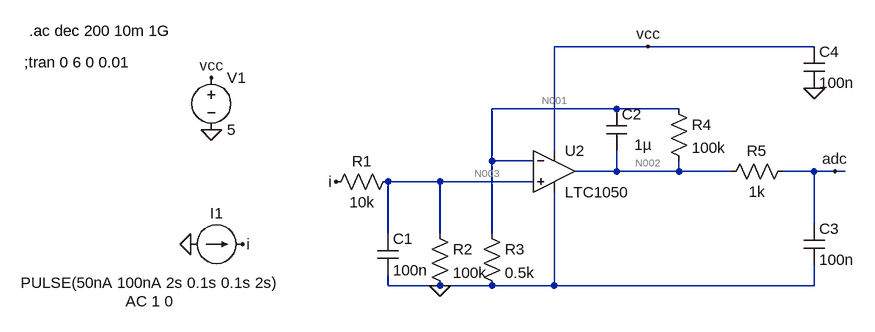
[diagram p0: schematic Draft1.asc]
Draft1.asc, the LTspice schematic file:
Version 4
SHEET 1 1016 680
WIRE 576 -64 432 -64
WIRE 832 -64 576 -64
WIRE 528 32 336 32
WIRE 624 32 528 32
WIRE 432 96 432 -64
WIRE 336 112 336 32
WIRE 400 112 336 112
WIRE 528 128 528 96
WIRE 528 128 464 128
WIRE 624 128 624 112
WIRE 624 128 528 128
WIRE 704 128 624 128
WIRE 832 128 784 128
WIRE 864 128 832 128
WIRE 880 128 864 128
WIRE 256 144 176 144
WIRE 400 144 256 144
WIRE 832 208 832 128
WIRE 176 224 176 144
WIRE 256 224 256 144
WIRE 336 224 336 112
WIRE 176 304 176 288
WIRE 256 304 176 304
WIRE 336 304 256 304
WIRE 432 304 432 160
WIRE 432 304 336 304
WIRE 832 304 832 272
WIRE 832 304 432 304
FLAG -128 240 0
FLAG 256 304 0
FLAG 832 0 0
FLAG 576 -64 vcc
FLAG 864 128 adc
FLAG 96 144 i
FLAG -48 240 i
FLAG -96 64 0
FLAG -96 -16 vcc
SYMBOL res 80 160 R270
WINDOW 0 32 56 VTop 2
WINDOW 3 0 56 VBottom 2
SYMATTR InstName R1
SYMATTR Value 10k
SYMBOL res 240 208 R0
SYMATTR InstName R2
SYMATTR Value 100k
SYMBOL res 320 208 R0
SYMATTR InstName R3
SYMATTR Value 0.5k
SYMBOL cap 160 224 R0
SYMATTR InstName C1
SYMATTR Value 100n
SYMBOL current -128 240 R270
WINDOW 0 32 40 VTop 2
WINDOW 3 -44 -63 VBottom 2
WINDOW 123 -72 -63 VBottom 2
WINDOW 39 0 0 Left 2
SYMATTR InstName I1
SYMATTR Value PULSE(50nA 100nA 2s 0.1s 0.1s 2s)
SYMATTR Value2 AC 1 0
SYMBOL cap 512 32 R0
WINDOW 3 43 55 Left 2
SYMATTR Value 1µ
SYMATTR InstName C2
SYMBOL res 608 16 R0
SYMATTR InstName R4
SYMATTR Value 100k
SYMBOL res 688 144 R270
WINDOW 0 32 56 VTop 2
WINDOW 3 0 56 VBottom 2
SYMATTR InstName R5
SYMATTR Value 1k
SYMBOL cap 816 208 R0
SYMATTR InstName C3
SYMATTR Value 100n
SYMBOL cap 816 -64 R0
SYMATTR InstName C4
SYMATTR Value 100n
SYMBOL voltage -96 -32 R0
SYMATTR InstName V1
SYMATTR Value 5
SYMBOL Opamps\\LTC1050 432 64 R0
SYMATTR InstName U2
TEXT -384 -40 Left 2 !;tran 0 6 0 0.01
TEXT -376 -88 Left 2 !.ac dec 200 10m 1G

The netlist it stands for:
* Draft1.asc
R1 i N003 10k
R2 N003 0 100k
R3 N001 0 0.5k
C1 N003 0 100n
I1 0 i PULSE(50nA 100nA 2s 0.1s 0.1s 2s) AC 1 0
C2 N001 N002 1µ
R4 N001 N002 100k
R5 N002 adc 1k
C3 adc 0 100n
C4 vcc 0 100n
V1 vcc 0 5
XU2 N003 N001 vcc 0 N002 LTC1050  ; pins In+ In- V+ V- OUT
;tran 0 6 0 0.01
.ac dec 200 10m 1G
.lib LTC.lib
.backanno
.end

* Results of the author's LTspice run, read from the files saved beside the schematic
* Operating Point, zero values left out:
*   V(i) = 5.5 mV
*   V(n003) = 5 mV
*   V(n001) = 5 mV
*   V(n002) = 1.005 V
*   V(adc) = 1.005 V
*   V(vcc) = 5 V
*   I(I1) = 50 nA
*   I(R4) = -10 µA
*   I(R3) = 10 µA
*   I(R2) = 50 nA
*   I(R1) = 50 nA
*   I(V1) = -756.6 µA
*   Ix(u2:3) = 756.6 µA
*   Ix(u2:4) = -746.6 µA
*   Ix(u2:5) = -10 µA
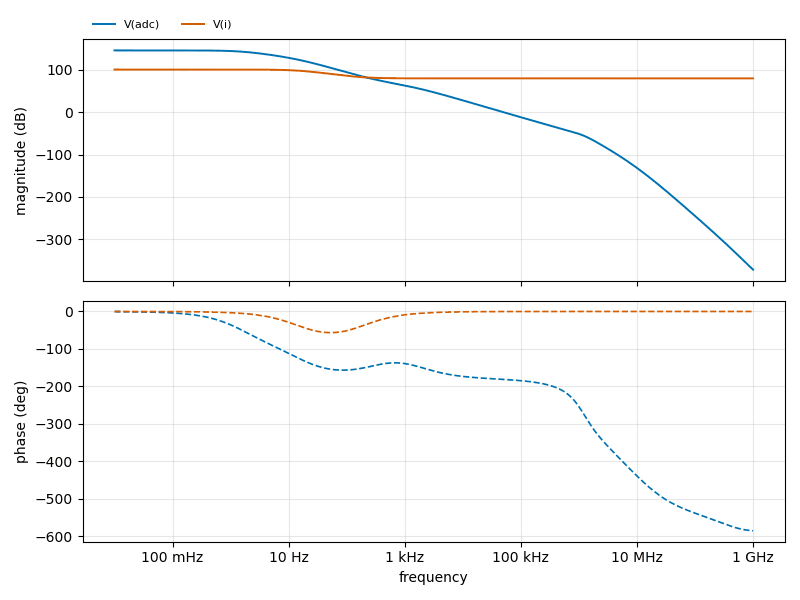
[diagram p1: AC Analysis of Draft1.asc, plotted from the saved traces]
* AC Analysis, 1 run:
*   V(adc): 146.06 dB at 10 mHz, -372.18 dB at 1 GHz, peak 146.06 dB at 10 mHz, 3 dB below the peak at 1.576 Hz
*   V(i): 100.83 dB at 10 mHz, 80.00 dB at 1 GHz, peak 100.83 dB at 10 mHz, 3 dB below the peak at 16.05 Hz